# EAGLE schematic HW6 (EAGLE 9.6.2)
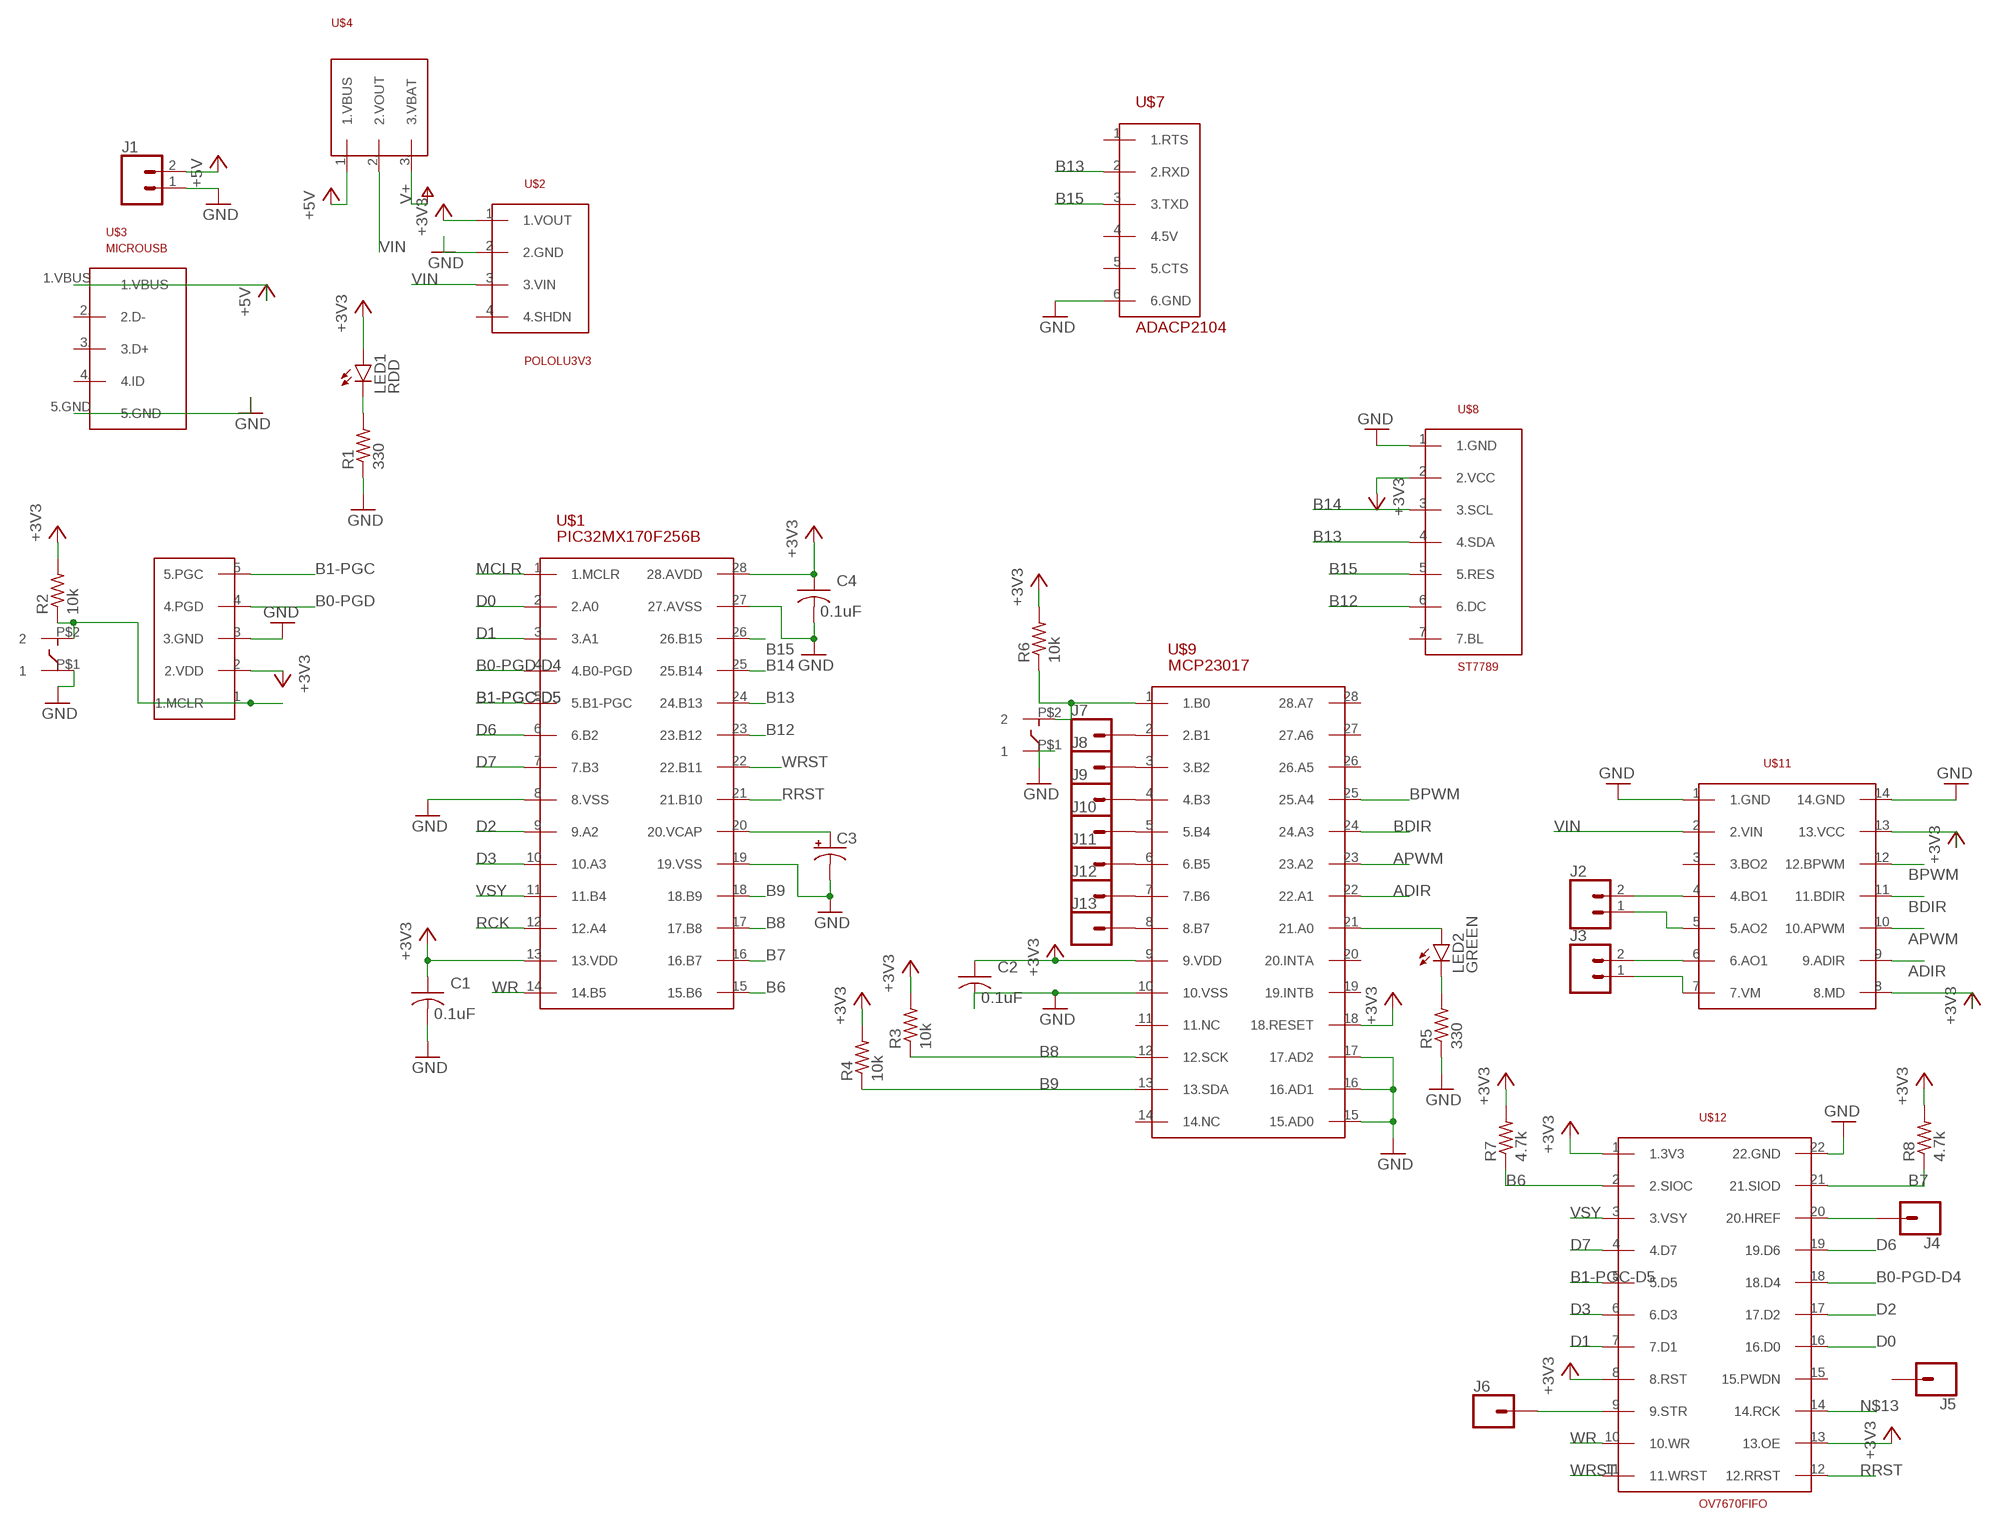
[diagram p0: schematic, sheet 1]

## Parts
C1  0.1uF  C-US025-030X050  [C025-030X050]
C2  0.1uF  C-US025-030X050  [C025-030X050]
C3  CPOL-USTAP5-70  [TAP5-70]
C4  0.1uF  C-US025-030X050  [C025-030X050]
J1  CONN_02  [1X02]
J2  CONN_02  [1X02]
J3  CONN_02  [1X02]
J4  CONN_01  [1X01]
J5  CONN_01  [1X01]
J6  CONN_01  [1X01]
J7  CONN_01  [1X01]
J8  CONN_01  [1X01]
J9  CONN_01  [1X01]
J10  CONN_01  [1X01]
J11  CONN_01  [1X01]
J12  CONN_01  [1X01]
J13  CONN_01  [1X01]
LED1  RDD  LED  [SMARTLED-TTW]
LED2  GREEN  LED  [SMARTLED-TTW]
R1  330  R-US_0204/2V  [0204V]
R2  10k  R-US_0204/2V  [0204V]
R3  10k  R-US_0204/2V  [0204V]
R4  10k  R-US_0204/2V  [0204V]
R5  330  R-US_0204/2V  [0204V]
R6  10k  R-US_0204/2V  [0204V]
R7  4.7k  R-US_0204/2V  [0204V]
R8  4.7k  R-US_0204/2V  [0204V]
U$1  PIC32MX170F256B  [DIL28-3]
U$2  POLOLU3V3  [POLOLU3V3]
U$3  MICROUSB  [MICROUSB]
U$4  SLIDE  [SLIDE]
U$5  SNAP  [SNAP]
U$6  PUSH  [PUSH]
U$7  ADACP2104  [ADACP2104]
U$8  ST7789  [ST7789]
U$9  MCP23017  [DIL28-3]
U$10  PUSH  [PUSH]
U$11  H-BRIDGE  [H-BRIDGE]
U$12  OV7670FIFO  [OV7670FIFO]

## Nets
+3V3: C1.1 C2.1 C4.1 LED1.A@1(A) R2.2 R3.2 R4.2 R6.2 R7.2 R8.2 U$1.13(13.VDD) U$1.28(28.AVDD) U$2.1(1.VOUT) U$5.2(2.VDD) U$8.2(2.VCC) U$9.9(9.VDD) U$9.18(18.RESET) U$11.8(8.MD) U$12.1(1.3V3) U$12.8(8.RST) U$12.13(13.OE)
+5V: J1.2 U$3.1.VBUS U$4.1.(1.VBUS)
ADIR: U$9.22(22.A1) U$11.9(9.ADIR)
APWM: U$9.23(23.A2) U$11.10(10.APWM)
B0-PGD: U$5.4(4.PGD)
B0-PGD-D4: U$1.4(4.B0-PGD) U$12.18(18.D4)
B1-PGC: U$5.5(5.PGC)
B1-PGC-D5: U$1.5(5.B1-PGC) U$12.5(5.D5)
B6: R7.1 U$1.15(15.B6) U$12.2(2.SIOC)
B7: R8.1 U$1.16(16.B7) U$12.21(21.SIOD)
B8: R3.1 U$1.17(17.B8) U$9.12(12.SCK)
B9: R4.1 U$1.18(18.B9) U$9.13(13.SDA)
B12: U$1.23(23.B12) U$8.6(6.DC)
B13: U$1.24(24.B13) U$7.2(2.RXD) U$8.4(4.SDA)
B14: U$1.25(25.B14) U$8.3(3.SCL)
B15: U$1.26(26.B15) U$7.3(3.TXD) U$8.5(5.RES)
BDIR: U$9.24(24.A3) U$11.11(11.BDIR)
BPWM: U$9.25(25.A4) U$11.12(12.BPWM)
D0: U$1.2(2.A0) U$12.16(16.D0)
D1: U$1.3(3.A1) U$12.7(7.D1)
D2: U$1.9(9.A2) U$12.17(17.D2)
D3: U$1.10(10.A3) U$12.6(6.D3)
D6: U$1.6(6.B2) U$12.19(19.D6)
D7: U$1.7(7.B3) U$12.4(4.D7)
GND: C1.2 C2.2 C3.- C4.2 J1.1 R1.1 R5.1 U$1.8(8.VSS) U$1.19(19.VSS) U$1.27(27.AVSS) U$2.2(2.GND) U$3.5.GND U$5.3(3.GND) U$6.P$1 U$7.6(6.GND) U$8.1(1.GND) U$9.10(10.VSS) U$9.15(15.AD0) U$9.16(16.AD1) U$9.17(17.AD2) U$10.P$1 U$11.14(14.GND) U$12.22(22.GND)
MCLR: R2.1 U$1.1(1.MCLR) U$5.1(1.MCLR) U$6.P$2
N$1: LED1.C@1(C) R1.2
N$2: C3.+ U$1.20(20.VCAP)
N$3: LED2.A@1(A) U$9.21(21.A0)
N$4: R6.1 U$9.1(1.B0) U$10.P$2
N$5: LED2.C@1(C) R5.2
N$6: U$11.1(1.GND) ; supply symbol labelled GND
N$7: U$11.13(13.VCC) ; supply symbol labelled +3V3
N$8: J2.2 U$11.4(4.BO1)
N$9: J2.1 U$11.5(5.AO2)
N$10: J3.2 U$11.6(6.AO1)
N$11: J3.1 U$11.7(7.VM)
N$12: J6.1 U$12.9(9.STR)
N$13: U$12.14(14.RCK)
N$14: J4.1 U$12.20(20.HREF)
N$15: J7.1 U$9.2(2.B1)
N$16: J8.1 U$9.3(3.B2)
N$17: J9.1 U$9.4(4.B3)
N$18: J10.1 U$9.5(5.B4)
N$19: J12.1 U$9.7(7.B6)
N$20: J13.1 U$9.8(8.B7)
N$21: J11.1 U$9.6(6.B5)
RCK: U$1.12(12.A4)
RRST: U$1.21(21.B10) U$12.12(12.RRST)
V+: U$4.3.(3.VBAT)
VIN: U$2.3(3.VIN) U$4.2.(2.VOUT) U$11.2(2.VIN)
VSY: U$1.11(11.B4) U$12.3(3.VSY)
WR: U$1.14(14.B5) U$12.10(10.WR)
WRST: U$1.22(22.B11) U$12.11(11.WRST)
Unconnected: J5.1 U$2.4(4.SHDN) U$3.2.(2.D-) U$3.3.(3.D+) U$3.4.(4.ID) U$7.1(1.RTS) U$7.4(4.5V) U$7.5(5.CTS) U$8.7(7.BL) U$9.11(11.NC) U$9.14(14.NC) U$9.19(19.INTB) U$9.20(20.INTA) U$9.26(26.A5) U$9.27(27.A6) U$9.28(28.A7) U$11.3(3.BO2) U$12.15(15.PWDN)

## Library data of the parts
C1 C2 C4 = me433:C-US: CAPACITOR, American symbol; SPICEPREFIX: C
C3 = me433:CPOL-US: POLARIZED CAPACITOR, American symbol; SPICEPREFIX: C
J1-J3 = me433:CONN_02: Multi connection point. Often used as Generic Header-pin footprint for 0.1 inch spaced/style header connections On any of the 0.1 inch spaced packages, you can populate with these: Break Away Headers - Straight <https://www.sparkfun.com/products/116> (PRT-00116) Break Away Male Headers - Right Angle <https://www.sparkfun.com/products/553> (PRT-00553) Female Headers <https://www.sparkfun.com/products/115> (PRT-00115) Break Away Headers - Machine Pin <https://www.sparkfun.com/products/117> (PRT-00117) Break Away Female Headers - Swiss Machine Pin <https://www.sparkfun.com/products/743> (PRT-00743) For SCREWTERMINALS and SPRING TERMINALS visit here: Screw Terimnals on SparkFun.com <https://www.sparkfun.com/search/results?term=Screw+Terminals> (5mm/3.5mm/2.54mm spacing) This device is also useful as a general connection point to wire up your design to another part of your project. Our various solder wires solder well into these plated through hole pads. Hook-Up Wire - Assortment (Stranded, 22 AWG) <https://www.sparkfun.com/products/11375> (PRT-11375) Hook-Up Wire - Assortment (Solid Core, 22 AWG) <https://www.sparkfun.com/products/11367> (PRT-11367) View the entire wire category on our website here <https://www.sparkfun.com/categories/141> Special notes: Molex polarized connector foot print use with: PRT-08233 with associated crimp pins and housings. 2.54_SCREWTERM for use with PRT-10571. 3.5mm Screw Terminal footprints for PRT-08084 5mm Screw Terminal footprints for use with PRT-08432
J4-J13 = me433:CONN_01: Single connection point. Often used as Generic Header-pin footprint for 0.1 inch spaced/style header connections On any of the 0.1 inch spaced packages, you can populate with these: Break Away Headers - Straight <https://www.sparkfun.com/products/116> (PRT-00116) Break Away Male Headers - Right Angle <https://www.sparkfun.com/products/553> (PRT-00553) Female Headers <https://www.sparkfun.com/products/115> (PRT-00115) Break Away Headers - Machine Pin <https://www.sparkfun.com/products/117> (PRT-00117) Break Away Female Headers - Swiss Machine Pin <https://www.sparkfun.com/products/743> (PRT-00743) This device is also useful as a general connection point to wire up your design to another part of your project. Our various solder wires solder well into these plated through hole pads. Hook-Up Wire - Assortment (Stranded, 22 AWG) <https://www.sparkfun.com/products/11375> (PRT-11375) Hook-Up Wire - Assortment (Solid Core, 22 AWG) <https://www.sparkfun.com/products/11367> (PRT-11367) View the entire wire category on our website here <https://www.sparkfun.com/categories/141> Special notes: SMTSO-256-ET is a "flush mount" nut for a 4-40 screw. We mostly use this on specialty testbeds; it is a nice way to connect hardware to your PCB at an adjustable hieght. Also note, the SNAP packages are for using a snappable style connector. We sell a baggie of snaps and they are also used on two LilyPad designs: Snap Assortment - 30 pack (male and female) <https://www.sparkfun.com/products/11347> (DEV-11347) LilyPad Arduino SimpleSnap <https://www.sparkfun.com/products/10941> (DEV-10941) LilyPad SimpleSnap Protoboard <https://www.sparkfun.com/products/10940> (DEV-10940)
LED1 LED2 = me433:LED: LED OSRAM: - CHIPLED LG R971, LG N971, LY N971, LG Q971, LY Q971, LO R971, LY R971 LH N974, LH R974 LS Q976, LO Q976, LY Q976 LO Q996 - Hyper CHIPLED LW Q18S LB Q993, LB Q99A, LB R99A - SideLED LS A670, LO A670, LY A670, LG A670, LP A670 LB A673, LV A673, LT A673, LW A673 LH A674 LY A675 LS A676, LA A676, LO A676, LY A676, LW A676 LS A679, LY A679, LG A679 - Hyper Micro SIDELED® LS Y876, LA Y876, LO Y876, LY Y876 LT Y87S - SmartLED LW L88C, LW L88S LB L89C, LB L89S, LG L890 LS L89K, LO L89K, LY L89K LS L896, LA L896, LO L896, LY L896 - TOPLED LS T670, LO T670, LY T670, LG T670, LP T670 LSG T670, LSP T670, LSY T670, LOP T670, LYG T670 LG T671, LOG T671, LSG T671 LB T673, LV T673, LT T673, LW T673 LH T674 LS T676, LA T676, LO T676, LY T676, LB T676, LH T676, LSB T676, LW T676 LB T67C, LV T67C, LT T67C, LS T67K, LO T67K, LY T67K, LW E67C LS E67B, LA E67B, LO E67B, LY E67B, LB E67C, LV E67C, LT E67C LW T67C LS T679, LY T679, LG T679 LS T770, LO T770, LY T770, LG T770, LP T770 LB T773, LV T773, LT T773, LW T773 LH T774 LS E675, LA E675, LY E675, LS T675 LS T776, LA T776, LO T776, LY T776, LB T776 LHGB T686 LT T68C, LB T68C - Hyper Mini TOPLED® LB M676 - Mini TOPLED Santana® LG M470 LS M47K, LO M47K, LY M47K Source: http://www.osram.convergy.de LUXEON: - LUMILED® LXK2-PW12-R00, LXK2-PW12-S00, LXK2-PW14-U00, LXK2-PW14-V00 LXK2-PM12-R00, LXK2-PM12-S00, LXK2-PM14-U00 LXK2-PE12-Q00, LXK2-PE12-R00, LXK2-PE12-S00, LXK2-PE14-T00, LXK2-PE14-U00 LXK2-PB12-K00, LXK2-PB12-L00, LXK2-PB12-M00, LXK2-PB14-N00, LXK2-PB14-P00, LXK2-PB14-Q00 LXK2-PR12-L00, LXK2-PR12-M00, LXK2-PR14-Q00, LXK2-PR14-R00 LXK2-PD12-Q00, LXK2-PD12-R00, LXK2-PD12-S00 LXK2-PH12-R00, LXK2-PH12-S00 LXK2-PL12-P00, LXK2-PL12-Q00, LXK2-PL12-R00 Source: www.luxeon.com KINGBRIGHT: KA-3528ASYC Source: www.kingbright.com
R1-R8 = me433:R-US_: RESISTOR, American symbol; SPICEPREFIX: R
U$1 = me433:PIC32MX170F256B
U$2 = me433:POLOLU3V3
U$3 = me433:MICROUSB
U$4 = me433:SLIDE
U$5 = me433:SNAP
U$6 U$10 = me433:PUSH
U$7 = me433:ADACP2104
U$8 = me433:ST7789
U$9 = me433:MCP23017
U$11 = me433:H-BRIDGE
U$12 = me433:OV7670FIFO